# EAGLE design board (EAGLE 8.7.1)
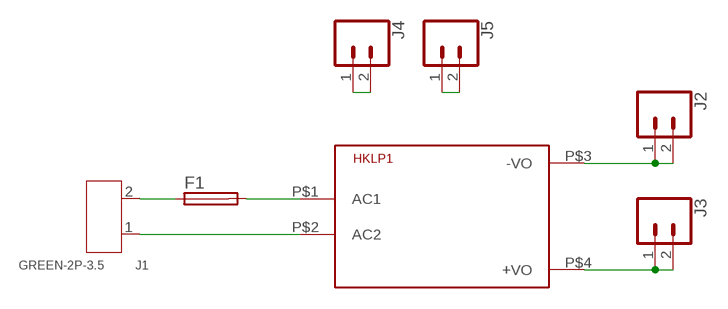
[diagram p0: schematic, sheet 1]

## Parts
F1  TR5  [TR5]
HKLP1  HKLPM01  [HKLPM01]
J1  GREEN-2P-3.5  SCREW-TERMINAL-GREEN(2P-3.5)  [H2-3.5-7.0X7.0MM]
J2  CONN_02  [1X02]
J3  CONN_02  [1X02]
J4  CONN_02  [1X02]
J5  CONN_02  [1X02]

## Nets
N$1: F1.1 J1.2
N$2: F1.2 HKLP1.P$1(AC1)
N$3: HKLP1.P$2(AC2) J1.1
N$4: HKLP1.P$4(+VO) J3.1 J3.2
N$9: J4.1 J4.2
N$11: HKLP1.P$3(-VO) J2.1 J2.2
N$14: J5.1 J5.2

## Library data of the parts
F1 = fuse:TR5: FUSE Wickmann; OC_FARNELL: unknown; OC_NEWARK: unknown
HKLP1 = HKLPM01:HKLPM01
J1 = Seeed-Connector:SCREW-TERMINAL-GREEN(2P-3.5): 320110028
J2-J5 = SparkFun-Connectors:CONN_02: Multi connection point. Often used as Generic Header-pin footprint for 0.1 inch spaced/style header connections On any of the 0.1 inch spaced packages, you can populate with these: Break Away Headers - Straight <https://www.sparkfun.com/products/116> (PRT-00116) Break Away Male Headers - Right Angle <https://www.sparkfun.com/products/553> (PRT-00553) Female Headers <https://www.sparkfun.com/products/115> (PRT-00115) Break Away Headers - Machine Pin <https://www.sparkfun.com/products/117> (PRT-00117) Break Away Female Headers - Swiss Machine Pin <https://www.sparkfun.com/products/743> (PRT-00743) For SCREWTERMINALS and SPRING TERMINALS visit here: Screw Terimnals on SparkFun.com <https://www.sparkfun.com/search/results?term=Screw+Terminals> (5mm/3.5mm/2.54mm spacing) This device is also useful as a general connection point to wire up your design to another part of your project. Our various solder wires solder well into these plated through hole pads. Hook-Up Wire - Assortment (Stranded, 22 AWG) <https://www.sparkfun.com/products/11375> (PRT-11375) Hook-Up Wire - Assortment (Solid Core, 22 AWG) <https://www.sparkfun.com/products/11367> (PRT-11367) View the entire wire category on our website here <https://www.sparkfun.com/categories/141> Special notes: Molex polarized connector foot print use with: PRT-08233 with associated crimp pins and housings. 2.54_SCREWTERM for use with PRT-10571. 3.5mm Screw Terminal footprints for PRT-08084 5mm Screw Terminal footprints for use with PRT-08432

## Board
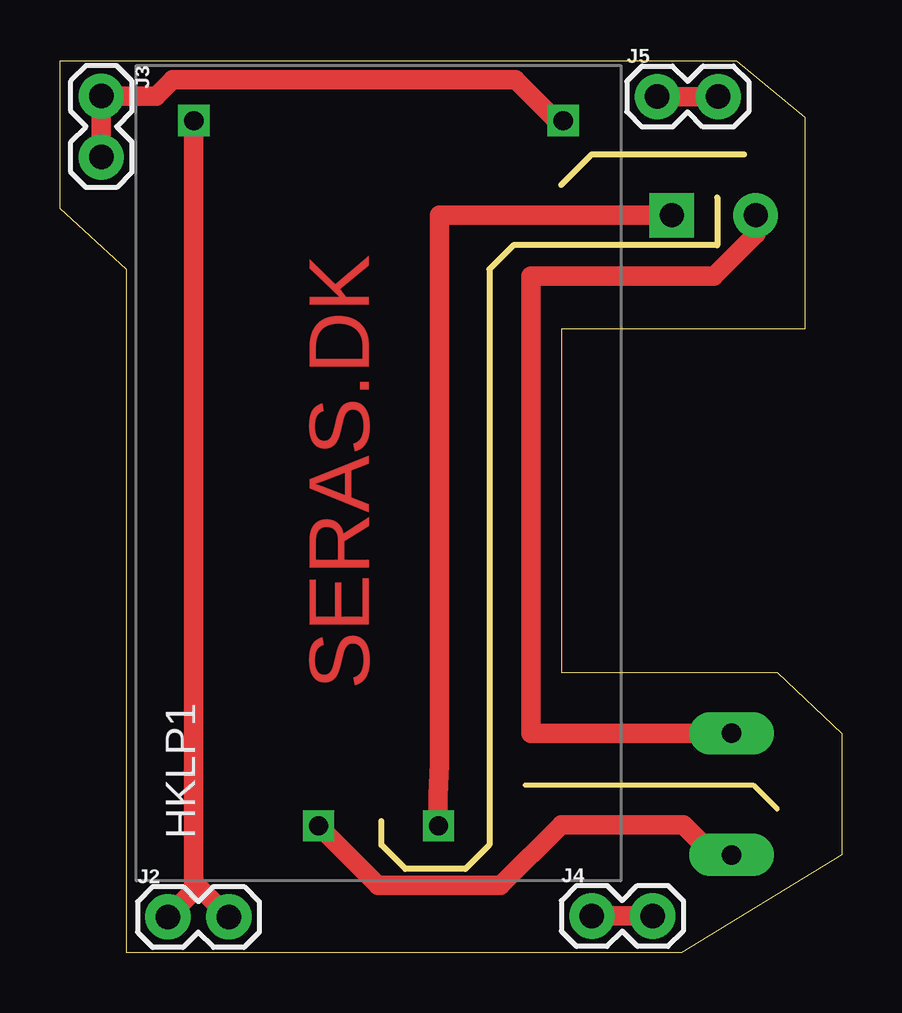
[diagram p1: board, top side]
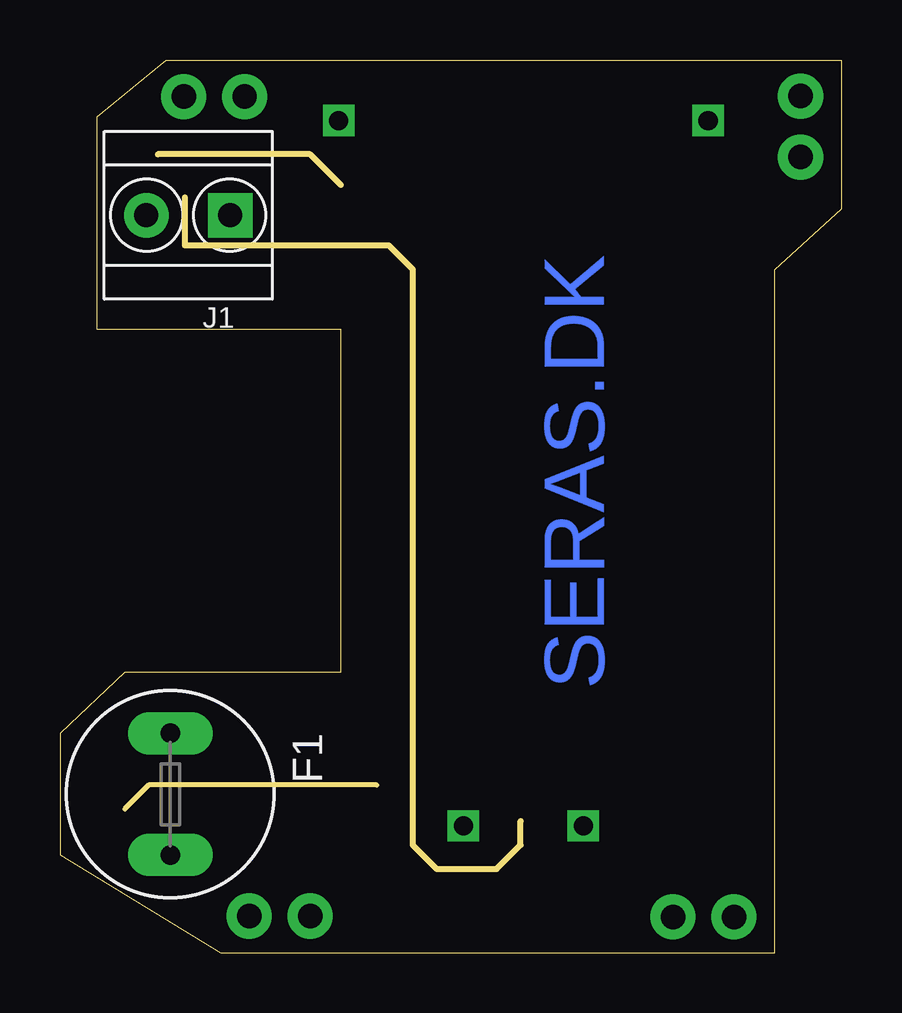
[diagram p2: board, bottom side, seen from below]

Size 32.6 x 37.2 mm. Coordinates in mm from the lower left corner, seen from the top.
Outline: 0,31.02 0,37.2 28.19,37.2 31.06,34.83 31.06,26 20.9,26 20.9,11.7 29.9,11.7 32.6,9.16 32.6,4.08 25.9,0 2.79,0 2.79,28.48 0,31.02
Copper layers (1*16): Top 0.035mm / dielectric 1.5mm / Bottom 0.035mm
Design rules "Itead": minimum track width 6mil, minimum drill 12mil, track to track 6mil, track to pad 6mil, pad to pad 6mil, via to via 6mil, smd to smd 0mil, copper to edge 10mil, drill to drill 10mil, minimum pad ring 10mil, minimum via ring 6mil, stop-mask expansion 2mil, vias tented up to drill 100mil, thermal gap 10mil
Milling: 12 lines

### Footprints (pad centres in the part's own frame; a part is rotated, then mirrored left to right if it is on the bottom)
TR5 = drill 0.813 pad 1.778 long: 1 -2.54,0; 2 2.54,0
HKLPM01 = drill 0.8 square: P$1 -14.7,2.5; P$2 -14.7,-2.5; P$3 14.7,7.7; P$4 14.7,-7.7
H2-3.5-7.0X7.0MM = drill 1 pad 1.85 square: 1 -1.75,0 | drill 1 pad 1.85: 2 1.75,0
1X02 = drill 1.016 pad 1.88: 1 0,0; 2 2.54,0

### Placement (x,y rotation side)
F1  28,6.62 270 bottom
HKLP1  13.28,20 90 top
J1  27.25,30.75 180 bottom
J2  4.5,1.5 0 top
J3  1.73,35.72 270 top
J4  22.17,1.54 0 top
J5  24.9,35.7 0 top

### Tracks (layer width: path | path; a pad name or v marks a point on that pad's centre or on a via)
N$1
  Top 0.813: F1.1 19.63,9.16 19.63,28.21 27.25,28.21 29,29.96 J1.2
N$2
  Top 0.813: HKLP1.P$1 13.27,2.81 18.36,2.81 20.9,5.35 25.98,5.35 27.25,4.08 F1.2
N$3
  Top 0.813: J1.1 15.82,30.75 15.82,7.89 15.77,6.57 HKLP1.P$2
N$4
  Top 0.813: HKLP1.P$4 20.7,34.7 18.99,36.41 4.7,36.41 4,35.72 J3.1 J3.2
N$9
  Top 0.813: J4.1 J4.2
N$11
  Top 0.813: HKLP1.P$3 5.58,2.96 | 5.58,2.96 J2.2 | J2.1 5.58,2.58 5.58,2.96
N$14
  Top 0.813: J5.1 J5.2

### Text on the board
Top: SERAS.DK
Bottom: SERAS.DK